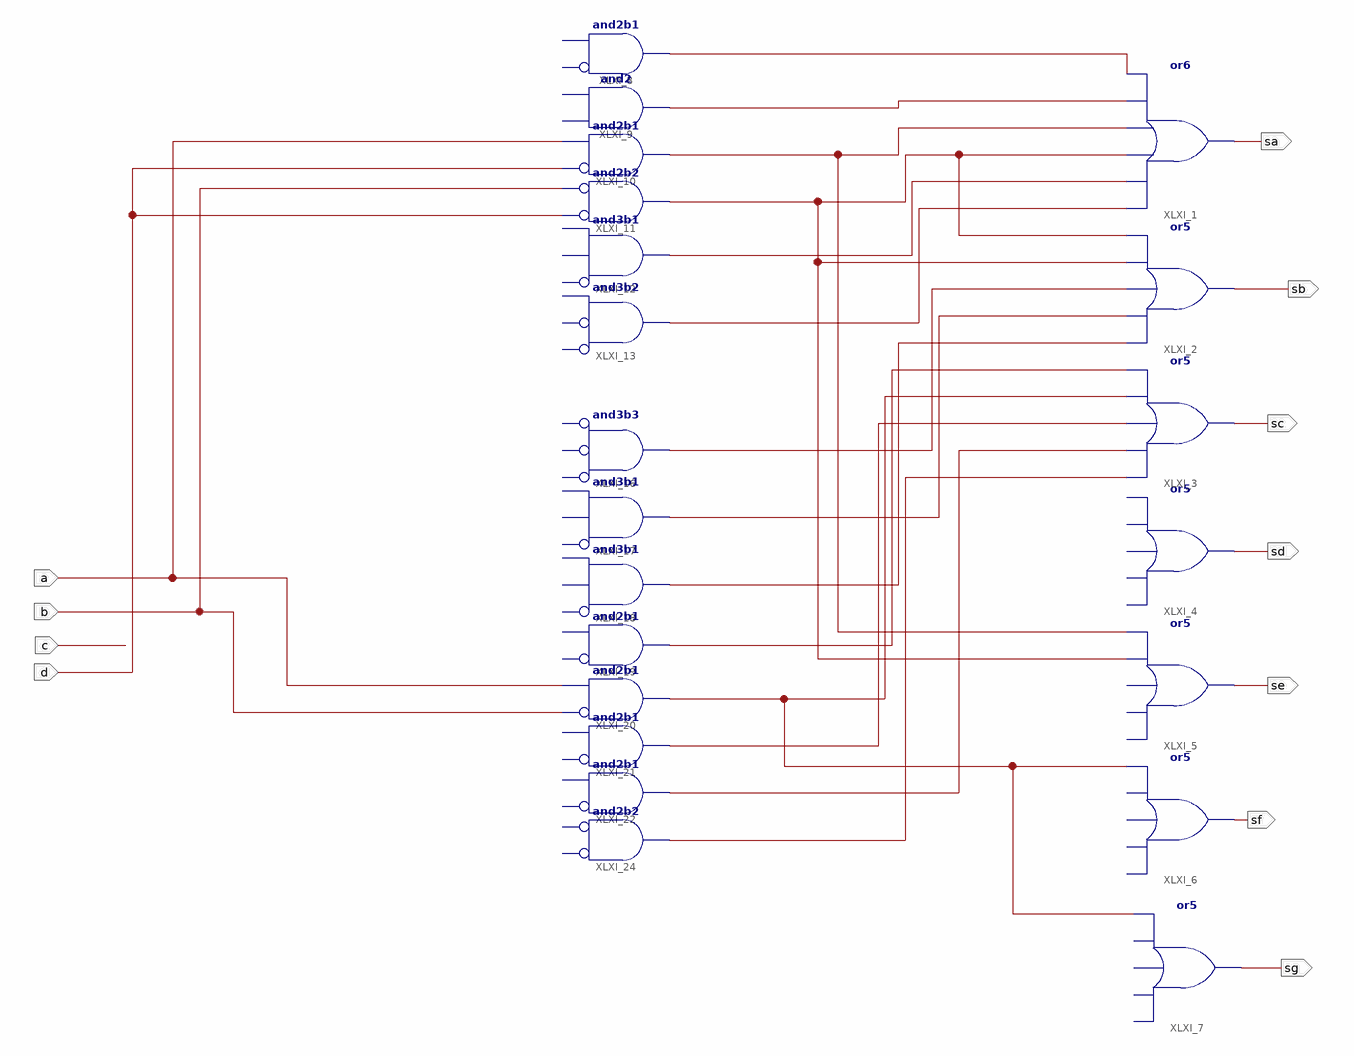
[diagram p0: schematic sheet 1]
// Xilinx ISE schematic reto2.sch (spartan3e) as structural Verilog: 21 symbols, 11 ports
module reto2 (
  input  a,
  input  c,
  input  d,
  input  b,
  output sa,
  output sb,
  output sc,
  output sd,
  output se,
  output sf,
  output sg
);

  wire XLXN_27, XLXN_28, XLXN_31, XLXN_33, XLXN_35, XLXN_37, XLXN_38, XLXN_39, XLXN_41, XLXN_43, XLXN_44,
       XLXN_45, XLXN_47, XLXN_54;

  or XLXI_1 (sa, XLXN_33, XLXN_31, XLXN_54, XLXN_35, XLXN_28, XLXN_27);
  or XLXI_2 (sb, XLXN_39, XLXN_38, XLXN_37, XLXN_54, XLXN_54);
  or XLXI_3 (sc, XLXN_45, XLXN_44, XLXN_43, XLXN_47, XLXN_41);
  // or5 XLXI_4 has open pins: I0=open, I1=open, I2=open, I3=open, I4=open, O=sd
  or XLXI_5 (se, XLXN_54, XLXN_35);  // open: I0, I1, I2
  buf XLXI_6 (sf, XLXN_47);  // or5 open: I0, I1, I2, I3
  buf XLXI_7 (sg, XLXN_47);  // or5 open: I0, I1, I2, I3
  // and2b1 XLXI_8 has open pins: I0=open, I1=open, O=XLXN_27
  // and2 XLXI_9 has open pins: I0=open, I1=open, O=XLXN_28
  and XLXI_10 (XLXN_35, ~d, a);  // and2b1
  and XLXI_11 (XLXN_54, ~d, ~b);  // and2b2
  // and3b1 XLXI_12 has open pins: I0=open, I1=open, I2=open, O=XLXN_31
  // and3b2 XLXI_13 has open pins: I0=open, I1=open, I2=open, O=XLXN_33
  // and3b3 XLXI_16 has open pins: I0=open, I1=open, I2=open, O=XLXN_37
  // and3b1 XLXI_17 has open pins: I0=open, I1=open, I2=open, O=XLXN_38
  // and3b1 XLXI_18 has open pins: I0=open, I1=open, I2=open, O=XLXN_39
  // and2b1 XLXI_19 has open pins: I0=open, I1=open, O=XLXN_41
  and XLXI_20 (XLXN_47, ~b, a);  // and2b1
  // and2b1 XLXI_21 has open pins: I0=open, I1=open, O=XLXN_43
  // and2b1 XLXI_22 has open pins: I0=open, I1=open, O=XLXN_44
  // and2b2 XLXI_24 has open pins: I0=open, I1=open, O=XLXN_45
endmodule
